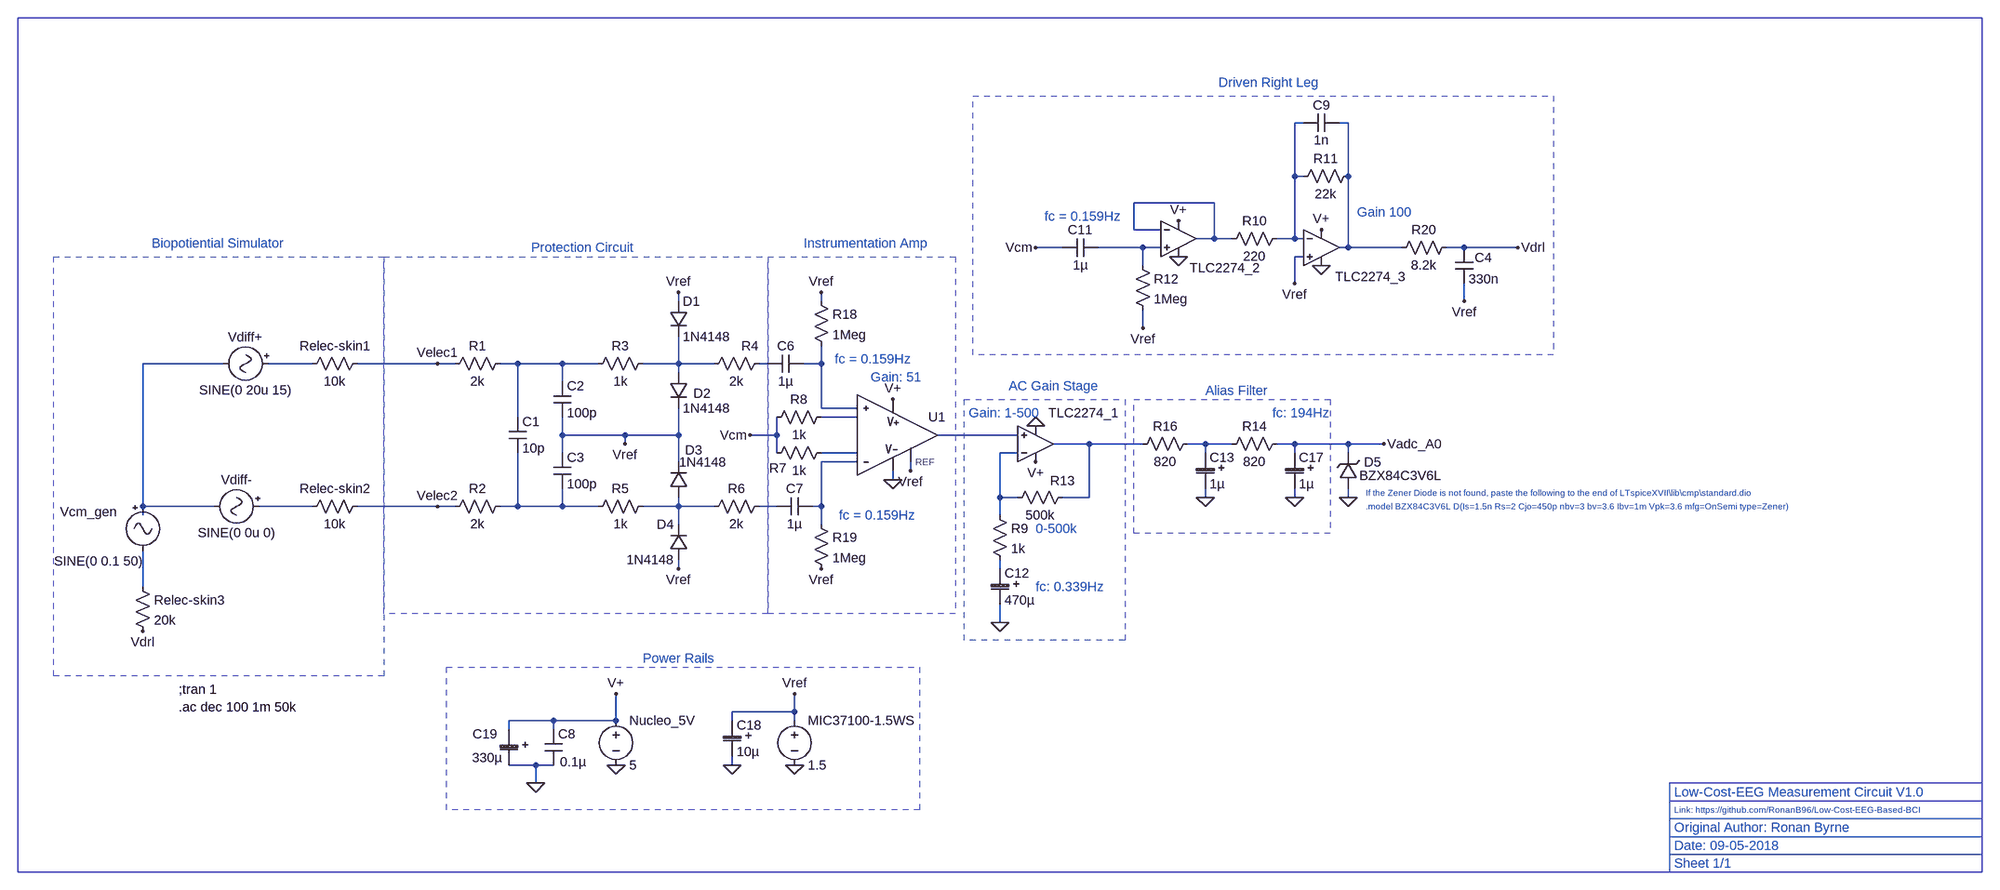
[diagram p0: schematic EEG_sch.asc]
EEG_sch.asc, the LTspice schematic file:
Version 4
SHEET 1 2900 1044
WIRE 1536 -384 1520 -384
WIRE 1616 -384 1600 -384
WIRE 1520 -288 1520 -384
WIRE 1536 -288 1520 -288
WIRE 1616 -288 1616 -384
WIRE 1376 -240 1232 -240
WIRE 1232 -192 1232 -240
WIRE 1280 -192 1232 -192
WIRE 1376 -176 1376 -240
WIRE 1376 -176 1344 -176
WIRE 1408 -176 1376 -176
WIRE 1520 -176 1520 -288
WIRE 1520 -176 1488 -176
WIRE 1536 -176 1520 -176
WIRE 1104 -160 1056 -160
WIRE 1248 -160 1168 -160
WIRE 1280 -160 1248 -160
WIRE 1616 -160 1616 -288
WIRE 1616 -160 1600 -160
WIRE 1712 -160 1616 -160
WIRE 1824 -160 1792 -160
WIRE 1920 -160 1824 -160
WIRE 1536 -144 1520 -144
WIRE 1248 -128 1248 -160
WIRE 1520 -96 1520 -144
WIRE 416 -64 416 -80
WIRE 672 -64 672 -80
WIRE 1824 -64 1824 -96
WIRE 1248 -16 1248 -48
WIRE -400 48 -544 48
WIRE -240 48 -320 48
WIRE -16 48 -160 48
WIRE 16 48 -16 48
WIRE 128 48 96 48
WIRE 208 48 128 48
WIRE 272 48 208 48
WIRE 416 48 416 0
WIRE 416 48 352 48
WIRE 480 48 416 48
WIRE 576 48 560 48
WIRE 672 48 672 16
WIRE 672 48 640 48
WIRE 416 64 416 48
WIRE 208 80 208 48
WIRE 672 128 672 48
WIRE 736 128 672 128
WIRE 128 144 128 48
WIRE 736 144 672 144
WIRE 208 176 208 144
WIRE 320 176 208 176
WIRE 416 176 416 128
WIRE 416 176 320 176
WIRE 592 176 592 144
WIRE 592 176 544 176
WIRE 1024 176 880 176
WIRE 320 192 320 176
WIRE 1152 192 1088 192
WIRE 1248 192 1152 192
WIRE 1360 192 1328 192
WIRE 1408 192 1360 192
WIRE 1520 192 1488 192
WIRE 1616 192 1520 192
WIRE 1680 192 1616 192
WIRE 208 208 208 176
WIRE 592 208 592 176
WIRE 736 208 672 208
WIRE 1024 208 992 208
WIRE 1360 208 1360 192
WIRE 1520 208 1520 192
WIRE 1616 208 1616 192
WIRE 416 224 416 176
WIRE 736 224 672 224
WIRE 832 240 832 224
WIRE 800 256 800 240
WIRE 992 288 992 208
WIRE 1024 288 992 288
WIRE 1152 288 1152 192
WIRE 1152 288 1104 288
WIRE 1360 288 1360 272
WIRE 1520 288 1520 272
WIRE 1616 288 1616 272
WIRE -544 304 -544 48
WIRE -416 304 -544 304
WIRE -240 304 -336 304
WIRE -16 304 -160 304
WIRE 16 304 -16 304
WIRE 128 304 128 208
WIRE 128 304 96 304
WIRE 208 304 208 272
WIRE 208 304 128 304
WIRE 272 304 208 304
WIRE 416 304 416 288
WIRE 416 304 352 304
WIRE 480 304 416 304
WIRE 592 304 560 304
WIRE 672 304 672 224
WIRE 672 304 656 304
WIRE -544 320 -544 304
WIRE 992 320 992 288
WIRE 416 336 416 304
WIRE 672 336 672 304
WIRE 416 416 416 400
WIRE 992 416 992 400
WIRE -544 448 -544 384
WIRE 992 512 992 480
WIRE 624 672 624 640
WIRE 624 672 512 672
WIRE 192 688 112 688
WIRE 304 688 304 640
WIRE 304 688 192 688
WIRE 512 688 512 672
WIRE 624 688 624 672
WIRE 112 704 112 688
WIRE 192 704 192 688
WIRE 160 768 112 768
WIRE 192 768 160 768
WIRE 512 768 512 752
WIRE 160 800 160 768
FLAG 624 768 0
FLAG 304 768 0
FLAG 304 640 V+
FLAG 624 640 Vref
FLAG 416 -80 Vref
FLAG 416 416 Vref
FLAG 320 192 Vref
FLAG -16 48 Velec1
FLAG -16 304 Velec2
FLAG 832 240 Vref
FLAG 800 112 V+
FLAG 800 256 0
FLAG 1312 -208 V+
FLAG 1312 -144 0
FLAG 1568 -128 0
FLAG 1568 -192 V+
FLAG 1248 -16 Vref
FLAG 1056 160 0
FLAG 1056 224 V+
FLAG 1520 -96 Vref
FLAG 672 416 Vref
FLAG 672 -80 Vref
FLAG 160 800 0
FLAG 512 768 0
FLAG 544 176 Vcm
FLAG 1056 -160 Vcm
FLAG 992 512 0
FLAG 1360 288 0
FLAG 1520 288 0
FLAG 1920 -160 Vdrl
FLAG 1616 288 0
FLAG 1680 192 Vadc_A0
FLAG -544 528 Vdrl
FLAG 1824 -64 Vref
SYMBOL res 112 32 R90
WINDOW 0 0 56 VBottom 2
WINDOW 3 32 56 VTop 2
SYMATTR InstName R1
SYMATTR Value 2k
SYMBOL res 112 288 R90
WINDOW 0 0 56 VBottom 2
WINDOW 3 32 56 VTop 2
SYMATTR InstName R2
SYMATTR Value 2k
SYMBOL cap 112 144 R0
SYMATTR InstName C1
SYMATTR Value 10p
SYMBOL cap 192 80 R0
SYMATTR InstName C2
SYMATTR Value 100p
SYMBOL cap 192 208 R0
SYMATTR InstName C3
SYMATTR Value 100p
SYMBOL res 368 32 R90
WINDOW 0 0 56 VBottom 2
WINDOW 3 32 56 VTop 2
SYMATTR InstName R3
SYMATTR Value 1k
SYMBOL res 576 32 R90
WINDOW 0 0 32 VBottom 2
WINDOW 3 32 56 VTop 2
SYMATTR InstName R4
SYMATTR Value 2k
SYMBOL res 368 288 R90
WINDOW 0 0 56 VBottom 2
WINDOW 3 32 56 VTop 2
SYMATTR InstName R5
SYMATTR Value 1k
SYMBOL res 576 288 R90
WINDOW 0 0 56 VBottom 2
WINDOW 3 32 56 VTop 2
SYMATTR InstName R6
SYMATTR Value 2k
SYMBOL diode 400 -64 R0
SYMATTR InstName D1
SYMATTR Value 1N4148
SYMBOL voltage 304 672 R0
WINDOW 123 0 0 Left 2
WINDOW 39 0 0 Left 2
SYMATTR InstName Nucleo_5V
SYMATTR Value 5
SYMBOL voltage 624 672 R0
WINDOW 123 0 0 Left 2
WINDOW 39 0 0 Left 2
SYMATTR InstName MIC37100-1.5WS
SYMATTR Value 1.5
SYMBOL res 688 192 R90
WINDOW 0 59 94 VBottom 2
WINDOW 3 32 56 VTop 2
SYMATTR InstName R7
SYMATTR Value 1k
SYMBOL res 688 128 R90
WINDOW 0 0 56 VBottom 2
WINDOW 3 32 56 VTop 2
SYMATTR InstName R8
SYMATTR Value 1k
SYMBOL Opamps\\UniversalOpamp2 1312 -176 R0
WINDOW 0 20 52 Left 2
SYMATTR InstName TLC2274_2
SYMBOL Opamps\\UniversalOpamp2 1568 -160 R0
WINDOW 0 25 52 Left 2
SYMATTR InstName TLC2274_3
SYMBOL res 1504 -192 R90
WINDOW 0 0 56 VBottom 2
WINDOW 3 32 56 VTop 2
SYMATTR InstName R10
SYMATTR Value 220
SYMBOL res 1632 -304 R90
WINDOW 0 0 56 VBottom 2
WINDOW 3 32 56 VTop 2
SYMATTR InstName R11
SYMATTR Value 22k
SYMBOL res 1232 -144 R0
SYMATTR InstName R12
SYMATTR Value 1Meg
SYMBOL Opamps\\UniversalOpamp2 1056 192 M180
WINDOW 0 23 56 Left 2
SYMATTR InstName TLC2274_1
SYMBOL res 976 304 R0
SYMATTR InstName R9
SYMATTR Value 1k
SYMBOL res 1504 176 R90
WINDOW 0 0 56 VBottom 2
WINDOW 3 32 56 VTop 2
SYMATTR InstName R14
SYMATTR Value 820
SYMBOL res -144 32 R90
WINDOW 0 0 56 VBottom 2
WINDOW 3 32 56 VTop 2
SYMATTR InstName Relec-skin1
SYMATTR Value 10k
SYMBOL res -144 288 R90
WINDOW 0 0 56 VBottom 2
WINDOW 3 32 56 VTop 2
SYMATTR InstName Relec-skin2
SYMATTR Value 10k
SYMBOL cap 640 32 R90
WINDOW 0 0 32 VBottom 2
WINDOW 3 32 32 VTop 2
SYMATTR InstName C6
SYMATTR Value 1µ
SYMBOL cap 656 288 R90
WINDOW 0 0 32 VBottom 2
WINDOW 3 32 32 VTop 2
SYMATTR InstName C7
SYMATTR Value 1µ
SYMBOL res 656 -80 R0
SYMATTR InstName R18
SYMATTR Value 1Meg
SYMBOL res 656 320 R0
SYMATTR InstName R19
SYMATTR Value 1Meg
SYMBOL diode 400 64 R0
WINDOW 0 43 37 Left 2
SYMATTR InstName D2
SYMATTR Value 1N4148
SYMBOL diode 432 288 R180
WINDOW 0 -27 85 Left 2
WINDOW 3 -70 63 Left 2
SYMATTR InstName D3
SYMATTR Value 1N4148
SYMBOL diode 432 400 R180
WINDOW 0 24 64 Left 2
WINDOW 3 24 0 Left 2
SYMATTR InstName D4
SYMATTR Value 1N4148
SYMBOL cap 176 704 R0
WINDOW 3 28 58 Left 2
SYMATTR Value 0.1µ
SYMATTR InstName C8
SYMBOL cap 1168 -176 R90
WINDOW 0 0 32 VBottom 2
WINDOW 3 32 32 VTop 2
SYMATTR InstName C11
SYMATTR Value 1µ
SYMBOL res 1808 -176 R90
WINDOW 0 0 56 VBottom 2
WINDOW 3 32 56 VTop 2
SYMATTR InstName R20
SYMATTR Value 8.2k
SYMBOL res 1120 272 R90
WINDOW 0 2 16 VBottom 2
WINDOW 3 32 56 VTop 2
SYMATTR InstName R13
SYMATTR Value 500k
SYMBOL res 1344 176 R90
WINDOW 0 0 56 VBottom 2
WINDOW 3 32 56 VTop 2
SYMATTR InstName R16
SYMATTR Value 820
SYMBOL Misc\\signal -304 48 R90
WINDOW 0 -32 56 VBottom 2
WINDOW 3 32 56 VTop 2
WINDOW 123 0 0 Left 2
WINDOW 39 0 0 Left 2
SYMATTR InstName Vdiff+
SYMATTR Value SINE(0 20u 15)
SYMBOL Misc\\signal -320 304 R90
WINDOW 0 -32 56 VBottom 2
WINDOW 3 32 56 VTop 2
WINDOW 123 0 0 Left 2
WINDOW 39 0 0 Left 2
SYMATTR InstName Vdiff-
SYMATTR Value SINE(0 0u 0)
SYMBOL res -560 432 R0
SYMATTR InstName Relec-skin3
SYMATTR Value 20k
SYMBOL cap 1600 -400 R90
WINDOW 0 0 32 VBottom 2
WINDOW 3 32 32 VTop 2
SYMATTR InstName C9
SYMATTR Value 1n
SYMBOL AD623 848 176 R0
SYMATTR InstName U1
SYMBOL PolCap 976 416 R0
SYMATTR InstName C12
SYMATTR Value 470µ
SYMBOL PolCap 1344 208 R0
SYMATTR InstName C13
SYMATTR Value 1µ
SYMBOL PolCap 1504 208 R0
SYMATTR InstName C17
SYMATTR Value 1µ
SYMBOL PolCap 496 688 R0
SYMATTR InstName C18
SYMATTR Value 10µ
SYMBOL PolCap 96 704 R0
WINDOW 0 -49 8 Left 2
WINDOW 3 -50 51 Left 2
SYMATTR InstName C19
SYMATTR Value 330µ
SYMBOL zener 1632 272 R180
WINDOW 0 -43 47 Left 2
WINDOW 3 -151 23 Left 2
SYMATTR InstName D5
SYMATTR Value BZX84C3V6L
SYMBOL Misc\\signal -544 288 R0
WINDOW 0 -148 26 Left 2
WINDOW 3 -159 114 Left 2
SYMATTR InstName Vcm_gen
SYMATTR Value SINE(0 0.1 50)
SYMBOL cap 1808 -160 R0
WINDOW 0 35 18 Left 2
SYMATTR InstName C4
SYMATTR Value 330n
TEXT -480 632 Left 2 !;tran 1
TEXT -480 664 Left 2 !.ac dec 100 1m 50k
TEXT 1648 280 Left 1 ;If the Zener Diode is not found, paste the following to the end of LTspiceXVII\\lib\\cmp\\standard.dio
TEXT 1648 304 Left 1 ;.model BZX84C3V6L D(Is=1.5n Rs=2 Cjo=450p nbv=3 bv=3.6 Ibv=1m Vpk=3.6 mfg=OnSemi type=Zener)
TEXT -528 -168 Left 2 ;Biopotiential Simulator
TEXT 1384 -456 Left 2 ;Driven Right Leg
TEXT 1360 96 Left 2 ;Alias Filter
TEXT 1008 88 Left 2 ;AC Gain Stage
TEXT 152 -160 Left 2 ;Protection Circuit
TEXT 640 -168 Left 2 ;Instrumentation Amp
TEXT 352 576 Left 2 ;Power Rails
TEXT 1056 344 Left 2 ;0-500k
TEXT 2200 816 Left 2 ;Low-Cost-EEG Measurement Circuit V1.0
TEXT 2200 880 Left 2 ;Original Author: Ronan Byrne
TEXT 2200 912 Left 2 ;Date: 09-05-2018
TEXT 2200 944 Left 2 ;Sheet 1/1
TEXT 760 72 Left 2 ;Gain: 51
TEXT 1632 -224 Left 2 ;Gain 100
TEXT 1480 136 Left 2 ;fc: 194Hz
TEXT 704 320 Left 2 ;fc = 0.159Hz
TEXT 696 40 Left 2 ;fc = 0.159Hz
TEXT 1072 -216 Left 2 ;fc = 0.159Hz
TEXT 1056 448 Left 2 ;fc: 0.339Hz
TEXT 2200 848 Left 1 ;Link: https://github.com/RonanB96/Low-Cost-EEG-Based-BCI
TEXT 936 136 Left 2 ;Gain: 1-500
LINE Normal 2864 864 2192 864
LINE Normal 2800 864 2864 864 2
LINE Normal 2864 896 2192 896
LINE Normal 2864 928 2192 928
LINE Normal 2192 960 2192 864 2
LINE Normal 2192 832 2192 960
LINE Normal 2864 800 2192 800
LINE Normal 2864 832 2192 832
LINE Normal 2192 800 2192 928
RECTANGLE Normal 576 496 -112 -144 2
RECTANGLE Normal 912 496 576 -144 2
RECTANGLE Normal 1216 544 928 112 2
RECTANGLE Normal 1584 352 1232 112 2
RECTANGLE Normal -112 608 -704 -144 2
RECTANGLE Normal 1984 32 944 -432 2
RECTANGLE Normal 848 848 0 592 2
RECTANGLE Normal 2864 960 -768 -592

The netlist it stands for:
* EEG_sch.asc
R1 N007 Velec1 2k
R2 N019 Velec2 2k
C1 N007 N019 10p
C2 N007 Vref 100p
C3 Vref N019 100p
R3 N008 N007 1k
R4 N009 N008 2k
R5 N020 N019 1k
R6 N021 N020 2k
D1 Vref N008 1N4148
V§Nucleo_5V V+ 0 5
V§MIC37100-1.5WS Vref 0 1.5
R7 N015 Vcm 1k
R8 N011 Vcm 1k
XTLC2274_2 N004 N003 V+ 0 N003 level.2 Avol=1Meg GBW=10Meg Slew=10Meg ilimit=25m rail=0 Vos=0 phimargin=45 en=0 enk=0 in=0 ink=0 Rin=500Meg  ; pins IN+ IN- V+ V- OUT
XTLC2274_3 Vref N001 V+ 0 N002 level.2 Avol=1Meg GBW=10Meg Slew=10Meg ilimit=25m rail=0 Vos=0 phimargin=45 en=0 enk=0 in=0 ink=0 Rin=500Meg  ; pins IN+ IN- V+ V- OUT
R10 N001 N003 220
R11 N002 N001 22k
R12 N004 Vref 1Meg
XTLC2274_1 N012 N016 V+ 0 N013 level.2 Avol=1Meg GBW=10Meg Slew=10Meg ilimit=25m rail=0 Vos=0 phimargin=45 en=0 enk=0 in=0 ink=0 Rin=500Meg  ; pins IN+ IN- V+ V- OUT
R9 N016 N022 1k
R14 Vadc_A0 N014 820
Relec-skin1 Velec1 N006 10k
Relec-skin2 Velec2 N018 10k
C6 N010 N009 1µ
C7 N017 N021 1µ
R18 Vref N010 1Meg
R19 N017 Vref 1Meg
D2 N008 Vref 1N4148
D3 N020 Vref 1N4148
D4 Vref N020 1N4148
C8 V+ 0 0.1µ
C11 N004 Vcm 1µ
R20 Vdrl N002 8.2k
R13 N013 N016 500k
R16 N014 N013 820
Vdiff+ N006 N005 SINE(0 20u 15)
Vdiff- N018 N005 SINE(0 0u 0)
Relec-skin3 N023 Vdrl 20k
C9 N002 N001 1n
XU1 N010 N017 N011 N015 V+ 0 N012 Vref AD623  ; pins In+ In- RG+ RG- V+ V- OUT REF
C12 N022 0 470µ
C13 N014 0 1µ
C17 Vadc_A0 0 1µ
C18 Vref 0 10µ
C19 V+ 0 330µ
D5 0 Vadc_A0 BZX84C3V6L
Vcm_gen N005 N023 SINE(0 0.1 50)
C4 Vdrl Vref 330n
.model D D
.lib standard.dio
;tran 1
.ac dec 100 1m 50k
* If the Zener Diode is not found, paste the following to the end of LTspiceXVII\lib\cmp\standard.dio
* .model BZX84C3V6L D(Is=1.5n Rs=2 Cjo=450p nbv=3 bv=3.6 Ibv=1m Vpk=3.6 mfg=OnSemi type=Zener)
* Biopotiential Simulator
* Driven Right Leg
* Alias Filter
* AC Gain Stage
* Protection Circuit
* Instrumentation Amp
* Power Rails
* 0-500k
* Low-Cost-EEG Measurement Circuit V1.0
* Original Author: Ronan Byrne
* Date: 09-05-2018
* Sheet 1/1
* Gain: 51
* Gain 100
* fc: 194Hz
* fc = 0.159Hz
* fc = 0.159Hz
* fc = 0.159Hz
* fc: 0.339Hz
* Link: https://github.com/RonanB96/Low-Cost-EEG-Based-BCI
* Gain: 1-500
.lib UniversalOpamps2.sub
.lib ad623.lib
.backanno
.end